# Altium schematic sheet GCC.SchDoc
size A
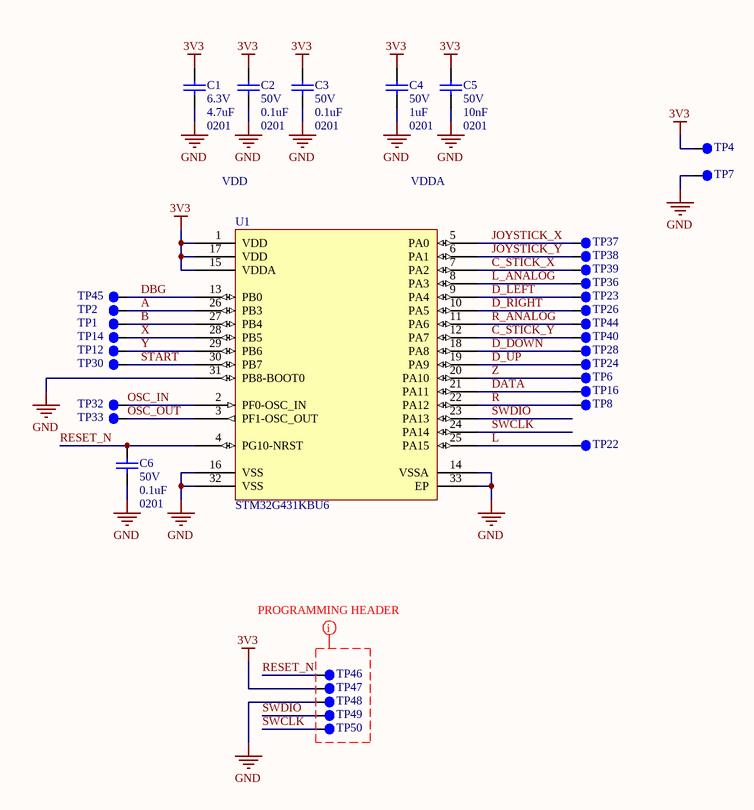
[diagram p0: GCC.SchDoc]

## Parts
C1  value 4.7uF  Rated Voltage: 6.3V  Package: 0201  [CAPC0603X03N]  (hidden comment: Capacitor)
C2  value 0.1uF  Rated Voltage: 50V  Package: 0201  [CAPC0603X03N]  (hidden comment: Capacitor)
C3  value 0.1uF  Rated Voltage: 50V  Package: 0201  [CAPC0603X03N]  (hidden comment: Capacitor)
C4  value 1uF  Rated Voltage: 50V  Package: 0201  [CAPC0603X03N]  (hidden comment: Capacitor)
C5  value 10nF  Rated Voltage: 50V  Package: 0201  [CAPC0603X03N]  (hidden comment: Capacitor)
C6  value 0.1uF  Rated Voltage: 50V  Package: 0201  [CAPC0603X03N]  (hidden comment: Capacitor)
TP1  Test Point  [TP_RECTANGULAR_0.5X1MM_CAST]  (value not drawn)
TP2  Test Point  [TP_RECTANGULAR_0.5X1MM_CAST]  (value not drawn)
TP4  Test Point  [TP_RECTANGULAR_0.5X1MM_CAST]  (value not drawn)
TP6  Test Point  [TP_RECTANGULAR_0.5X1MM_CAST]  (value not drawn)
TP7  Test Point  [TP_RECTANGULAR_0.5X1MM_CAST]  (value not drawn)
TP8  Test Point  [TP_RECTANGULAR_0.5X1MM_CAST]  (value not drawn)
TP12  Test Point  [TP_RECTANGULAR_0.5X1MM_CAST]  (value not drawn)
TP14  Test Point  [TP_RECTANGULAR_0.5X1MM_CAST]  (value not drawn)
TP16  Test Point  [TP_RECTANGULAR_0.5X1MM_CAST]  (value not drawn)
TP22  Test Point  [TP_RECTANGULAR_0.5X1MM_CAST]  (value not drawn)
TP23  Test Point  [TP_RECTANGULAR_0.5X1MM_CAST]  (value not drawn)
TP24  Test Point  [TP_RECTANGULAR_0.5X1MM_CAST]  (value not drawn)
TP26  Test Point  [TP_RECTANGULAR_0.5X1MM_CAST]  (value not drawn)
TP28  Test Point  [TP_RECTANGULAR_0.5X1MM_CAST]  (value not drawn)
TP30  Test Point  [TP_RECTANGULAR_0.5X1MM_CAST]  (value not drawn)
TP32  Test Point  [TP_RECTANGULAR_0.5X1MM_CAST]  (value not drawn)
TP33  Test Point  [TP_RECTANGULAR_0.5X1MM_CAST]  (value not drawn)
TP36  Test Point  [TP_RECTANGULAR_0.5X1MM_CAST]  (value not drawn)
TP37  Test Point  [TP_RECTANGULAR_0.5X1MM_CAST]  (value not drawn)
TP38  Test Point  [TP_RECTANGULAR_0.5X1MM_CAST]  (value not drawn)
TP39  Test Point  [TP_RECTANGULAR_0.5X1MM_CAST]  (value not drawn)
TP40  Test Point  [TP_RECTANGULAR_0.5X1MM_CAST]  (value not drawn)
TP44  Test Point  [TP_RECTANGULAR_0.5X1MM_CAST]  (value not drawn)
TP45  Test Point  [TP_CIRCULAR_SMD_0.75MM]  (value not drawn)
TP46  Test Point  [TP_CIRCULAR_SMD_0.75MM]  (value not drawn)
TP47  Test Point  [TP_CIRCULAR_SMD_0.75MM]  (value not drawn)
TP48  Test Point  [TP_CIRCULAR_SMD_0.75MM]  (value not drawn)
TP49  Test Point  [TP_CIRCULAR_SMD_0.75MM]  (value not drawn)
TP50  Test Point  [TP_CIRCULAR_SMD_0.75MM]  (value not drawn)
U1  STM32G431KBU6  [QFN50P500X500X60_HS-33N]

## Nets
3V3: C1.2 C2.2 C3.2 C4.2 C5.2 TP4.1 TP47.1 U1.1(VDD) U1.15(VDDA) U1.17(VDD)
GND: C1.1 C2.1 C3.1 C4.1 C5.1 C6.1 TP7.1 TP48.1 U1.14(VSSA) U1.16(VSS) U1.31(PB8-BOOT0) U1.32(VSS) U1.33(EP)
A: TP2.1 U1.26(PB3)
B: TP1.1 U1.27(PB4)
C_STICK_X: TP39.1 U1.7(PA2)
C_STICK_Y: TP40.1 U1.12(PA7)
D_DOWN: TP28.1 U1.18(PA8)
D_LEFT: TP23.1 U1.9(PA4)
D_RIGHT: TP26.1 U1.10(PA5)
D_UP: TP24.1 U1.19(PA9)
DATA: TP16.1 U1.21(PA11)
DBG: TP45.1 U1.13(PB0)
JOYSTICK_X: TP37.1 U1.5(PA0)
JOYSTICK_Y: TP38.1 U1.6(PA1)
L: TP22.1 U1.25(PA15)
L_ANALOG: TP36.1 U1.8(PA3)
OSC_IN: TP32.1 U1.2(PF0-OSC_IN)
OSC_OUT: TP33.1 U1.3(PF1-OSC_OUT)
R: TP8.1 U1.22(PA12)
R_ANALOG: TP44.1 U1.11(PA6)
RESET_N: C6.2 TP46.1 U1.4(PG10-NRST)
START: TP30.1 U1.30(PB7)
SWCLK: TP50.1 U1.24(PA14)
SWDIO: TP49.1 U1.23(PA13)
X: TP14.1 U1.28(PB5)
Y: TP12.1 U1.29(PB6)
Z: TP6.1 U1.20(PA10)

## Layout directives
mark named PROGRAMMING HEADER: (no net found under the mark)

## Notes on the sheet
- VDD
- VDDA

## Library data of the parts
C1-C6 = Capacitor: General purpose capacitor
TP1 TP2 TP4 TP6-TP8 TP12 TP14 TP16 TP22-TP24 TP26 TP28 TP30 TP32 TP33 TP36-TP40 TP44-TP50 = Test Point: General purpose test point
U1 = STM32G431KBU6: MCU 32-Bit ARM Cortex-M4 RISC 128KB Flash 1.71V to 3.6V 32-Pin UFQFPN; Manufacturer: STMicroelectronics; Supplier 1: Digi-Key; Manufacturer Part Number: STM32G431KBU6; RoHS: No; Stock 1: 2759; Pricing 1: 1=4.44000, 10=3.99100, 25=3.77320, 100=3.27000, 250=3.10228, 500=2.78366, 1000=2.34766, 2500=2.23028, 5000=2.14643 (USD)